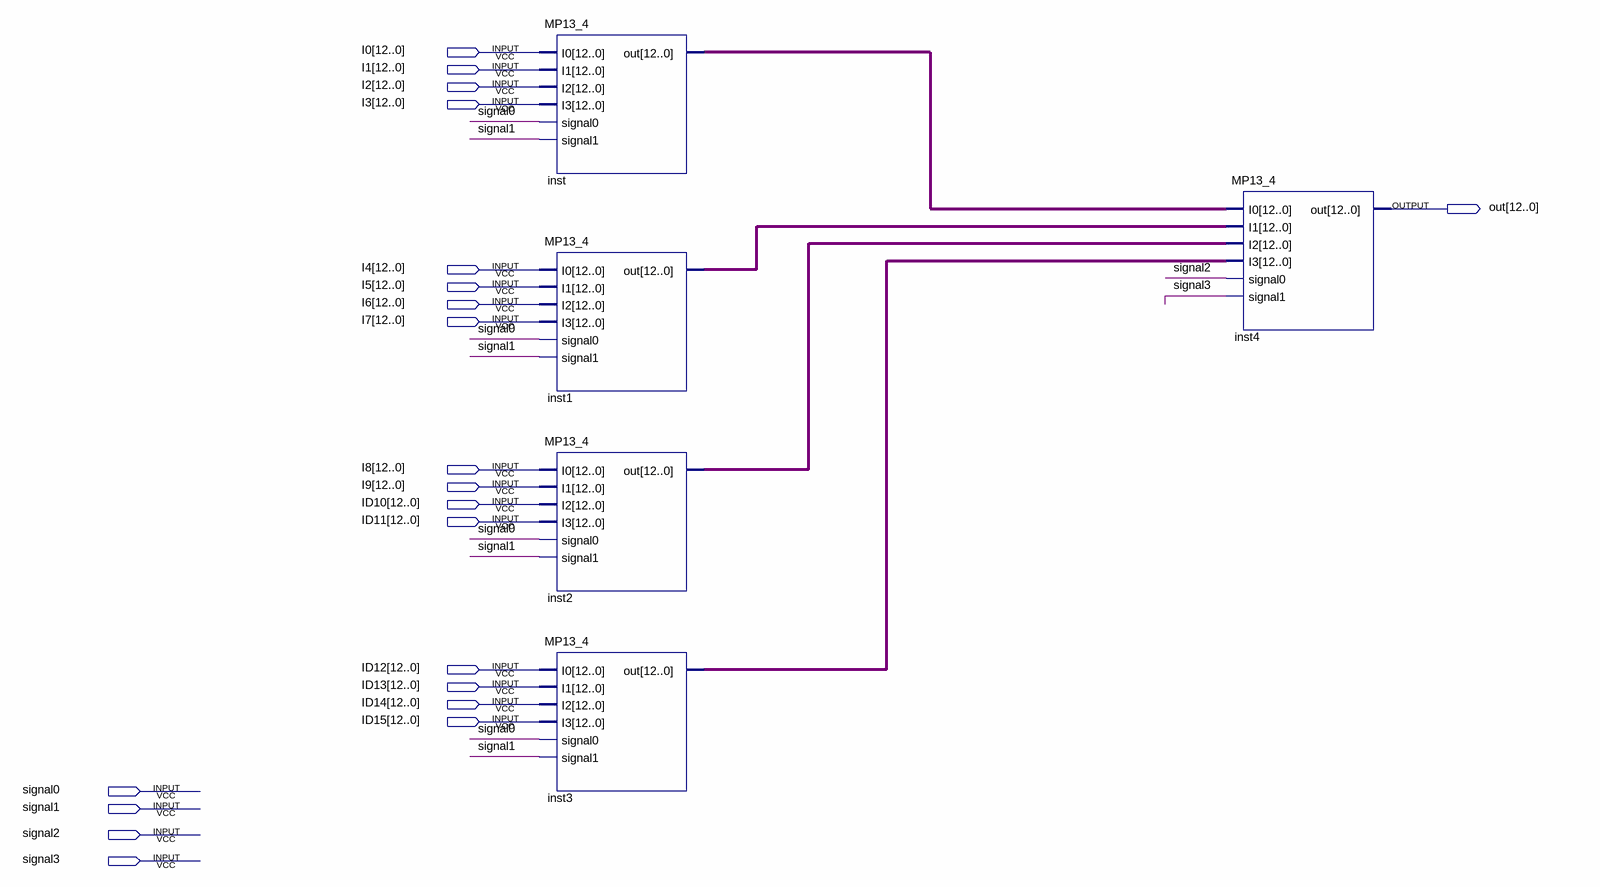
[diagram p0: schematic sheet]
// Quartus schematic MP13_16.bdf as structural Verilog: 5 symbols, 21 pins
module MP13_16 (
  input  [12:0] I0,
  input  [12:0] I1,
  input  [12:0] I2,
  input  [12:0] I3,
  input  [12:0] I4,
  input  [12:0] I5,
  input  [12:0] I6,
  input  [12:0] I7,
  input  [12:0] I8,
  input  [12:0] I9,
  input  [12:0] ID10,
  input  [12:0] ID11,
  input  [12:0] ID12,
  input  [12:0] ID13,
  input  [12:0] ID14,
  input  [12:0] ID15,
  input  signal0,
  input  signal1,
  input  signal2,
  input  signal3,
  output [12:0] out
);

  wire [12:0] inst1_out, inst2_out, inst3_out, inst_out;

  MP13_4 inst (.I0(I0), .I1(I1), .I2(I2), .I3(I3), .signal0(signal0), .signal1(signal1), .out(inst_out));
  MP13_4 inst1 (.I0(I4), .I1(I5), .I2(I6), .I3(I7), .signal0(signal0), .signal1(signal1), .out(inst1_out));
  MP13_4 inst2 (.I0(I8), .I1(I9), .I2(ID10), .I3(ID11), .signal0(signal0), .signal1(signal1), .out(inst2_out));
  MP13_4 inst3 (.I0(ID12), .I1(ID13), .I2(ID14), .I3(ID15), .signal0(signal0), .signal1(signal1), .out(inst3_out));
  MP13_4 inst4 (
    .I0(inst_out), .I1(inst1_out), .I2(inst2_out), .I3(inst3_out), .signal0(signal2), .signal1(signal3),
    .out(out));
endmodule
